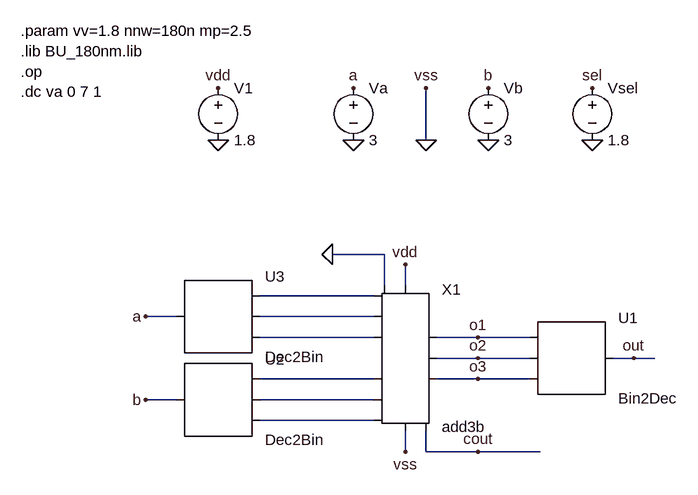
[diagram p0: schematic add3b_test.asc]
add3b_test.asc, the LTspice schematic file:
Version 4
SHEET 1 880 680
WIRE 464 -16 464 -96
WIRE 400 160 320 160
WIRE 400 208 400 160
WIRE 432 208 432 176
WIRE 384 224 208 224
WIRE 80 256 32 256
WIRE 384 256 208 256
WIRE 384 288 208 288
WIRE 544 288 480 288
WIRE 624 288 544 288
WIRE 544 320 480 320
WIRE 624 320 544 320
WIRE 784 320 752 320
WIRE 816 320 784 320
WIRE 384 352 208 352
WIRE 544 352 480 352
WIRE 624 352 544 352
WIRE 80 384 32 384
WIRE 384 384 208 384
WIRE 384 416 208 416
WIRE 432 464 432 432
WIRE 464 464 464 432
WIRE 544 464 464 464
WIRE 640 464 544 464
FLAG 784 320 out
FLAG 144 -16 0
FLAG 352 -16 0
FLAG 560 -16 0
FLAG 352 -96 a
FLAG 560 -96 b
FLAG 32 256 a
FLAG 32 384 b
FLAG 720 -16 0
FLAG 720 -96 sel
FLAG 320 160 0
FLAG 544 352 o3
FLAG 544 320 o2
FLAG 544 288 o1
FLAG 544 464 cout
FLAG 144 -96 vdd
FLAG 432 176 vdd
FLAG 432 464 vss
FLAG 464 -16 0
FLAG 464 -96 vss
SYMBOL Bin2Dec 688 320 R0
SYMATTR InstName U1
SYMATTR SpiceLine Vhigh={vv}
SYMBOL Dec2Bin 144 384 R0
SYMATTR InstName U2
SYMATTR SpiceLine Vhigh={vv}
SYMBOL Dec2Bin 144 256 R0
SYMATTR InstName U3
SYMATTR SpiceLine Vhigh={vv}
SYMBOL /voltage 144 -112 R0
SYMATTR InstName V1
SYMATTR Value 1.8
SYMBOL /voltage 352 -112 R0
SYMATTR InstName Va
SYMATTR Value 3
SYMBOL /voltage 560 -112 R0
SYMATTR InstName Vb
SYMATTR Value 3
SYMBOL /voltage 720 -112 R0
SYMATTR InstName Vsel
SYMATTR Value 1.8
SYMBOL add3b 432 320 R0
SYMATTR InstName X1
TEXT -160 -184 Left 2 !.param vv=1.8 nnw=180n mp=2.5\n.lib BU_180nm.lib\n.op\n.dc va 0 7 1

The netlist it stands for:
* add3b_test.asc
XU1 o1 o2 o3 out Bin2Dec Vhigh={vv}
XU2 b N004 N005 N006 Dec2Bin Vhigh={vv}
XU3 a N001 N002 N003 Dec2Bin Vhigh={vv}
V1 vdd 0 1.8
Va a 0 3
Vb b 0 3
Vsel sel 0 1.8
XX1 vdd N001 N002 N003 N004 N005 N006 0 o1 o2 o3 cout 0 add3b
.param vv=1.8 nnw=180n mp=2.5
.lib BU_180nm.lib
.op
.dc va 0 7 1
.lib BIN2DEC.sub
.lib DEC2BIN.sub
.backanno
.end